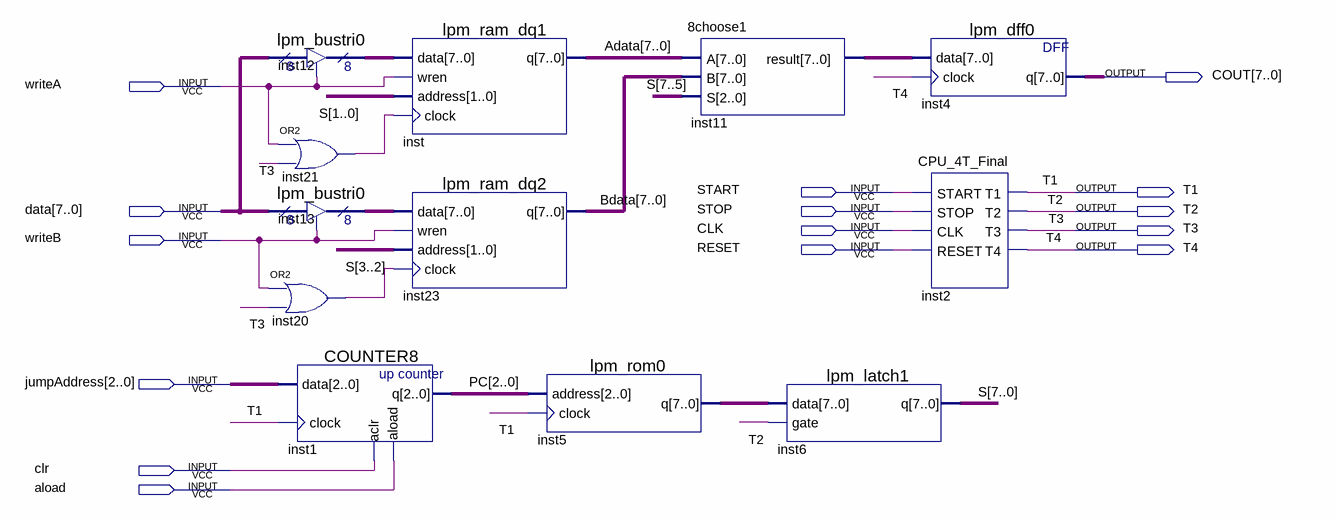
[diagram p0: schematic sheet]
// Quartus schematic CPU.bdf as structural Verilog: 12 symbols, 15 pins
module CPU (
  input  writeA,
  input  START,
  input  [7:0] data,
  input  STOP,
  input  CLK,
  input  writeB,
  input  RESET,
  input  [2:0] jumpAddress,
  input  clr,
  input  aload,
  output [7:0] COUT,
  output T1,
  output T2,
  output T3,
  output T4
);

  wire inst20_out, inst21_out;
  wire [2:0] PC;
  wire [7:0] Adata, Bdata, inst5_q, inst11_result, inst12_tridata, inst13_tridata, S;

  lpm_bustri0 inst12 (.enabledt(writeA), .data(data), .tridata(inst12_tridata));
  or inst21 (inst21_out, writeA, T3);
  lpm_bustri0 inst13 (.enabledt(writeB), .data(data), .tridata(inst13_tridata));
  or inst20 (inst20_out, writeB, T3);
  COUNTER8 inst1 (.data(jumpAddress), .clock(T1), .aclr(clr), .aload(aload), .q(PC));
  lpm_ram_dq1 inst (.data(inst12_tridata), .wren(writeA), .address(S[1:0]), .clock(inst21_out), .q(Adata));
  lpm_ram_dq2 inst23 (.data(inst13_tridata), .wren(writeB), .address(S[3:2]), .clock(inst20_out), .q(Bdata));
  lpm_rom0 inst5 (.address(PC), .clock(T1), .q(inst5_q));
  \8choose1  inst11 (.A(Adata), .B(Bdata), .S(S[7:5]), .result(inst11_result));
  lpm_latch1 inst6 (.data(inst5_q), .gate(T2), .q(S));
  lpm_dff0 inst4 (.data(inst11_result), .clock(T4), .q(COUT));
  CPU_4T_Final inst2 (.START(START), .STOP(STOP), .CLK(CLK), .RESET(RESET), .T1(T1), .T2(T2), .T3(T3), .T4(T4));
endmodule
